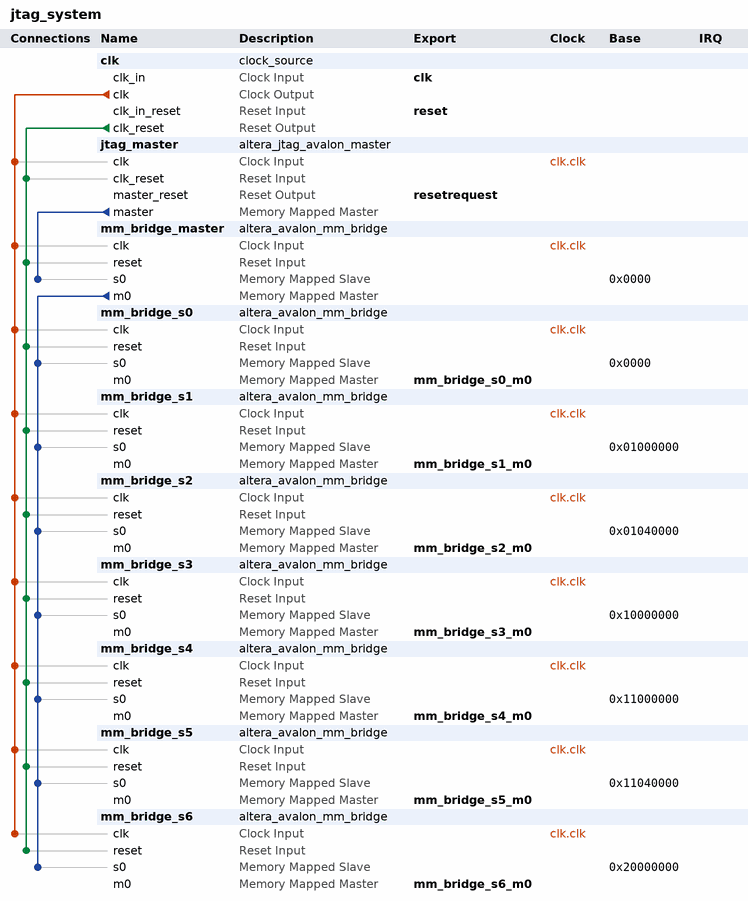
[diagram p0: system contents]
# Platform Designer (Qsys) system jtag_system, Arria V 5ASTMD3E3F31I3
# Parameters at their usual value, and those the tool derives, are not listed.
package require -exact qsys 14.0
create_system jtag_system
set_project_property DEVICE_FAMILY {Arria V}
set_project_property DEVICE 5ASTMD3E3F31I3

add_instance clk clock_source 14.0
set_instance_parameter_value clk clockFrequency 50000000
set_instance_parameter_value clk clockFrequencyKnown false

add_instance jtag_master altera_jtag_avalon_master 14.0

add_instance mm_bridge_master altera_avalon_mm_bridge 14.0
set_instance_parameter_value mm_bridge_master DATA_WIDTH 32
set_instance_parameter_value mm_bridge_master ADDRESS_WIDTH 32
set_instance_parameter_value mm_bridge_master USE_AUTO_ADDRESS_WIDTH 0
set_instance_parameter_value mm_bridge_master ADDRESS_UNITS SYMBOLS
set_instance_parameter_value mm_bridge_master MAX_BURST_SIZE 8
set_instance_parameter_value mm_bridge_master MAX_PENDING_RESPONSES 1
set_instance_parameter_value mm_bridge_master PIPELINE_COMMAND 0
set_instance_parameter_value mm_bridge_master PIPELINE_RESPONSE 0

add_instance mm_bridge_s0 altera_avalon_mm_bridge 14.0
set_instance_parameter_value mm_bridge_s0 DATA_WIDTH 32
set_instance_parameter_value mm_bridge_s0 ADDRESS_WIDTH 24
set_instance_parameter_value mm_bridge_s0 USE_AUTO_ADDRESS_WIDTH 0
set_instance_parameter_value mm_bridge_s0 ADDRESS_UNITS SYMBOLS
set_instance_parameter_value mm_bridge_s0 MAX_BURST_SIZE 8
set_instance_parameter_value mm_bridge_s0 MAX_PENDING_RESPONSES 1
set_instance_parameter_value mm_bridge_s0 PIPELINE_COMMAND 0
set_instance_parameter_value mm_bridge_s0 PIPELINE_RESPONSE 0

add_instance mm_bridge_s1 altera_avalon_mm_bridge 14.0
set_instance_parameter_value mm_bridge_s1 DATA_WIDTH 32
set_instance_parameter_value mm_bridge_s1 ADDRESS_WIDTH 18
set_instance_parameter_value mm_bridge_s1 USE_AUTO_ADDRESS_WIDTH 0
set_instance_parameter_value mm_bridge_s1 ADDRESS_UNITS SYMBOLS
set_instance_parameter_value mm_bridge_s1 MAX_BURST_SIZE 8
set_instance_parameter_value mm_bridge_s1 MAX_PENDING_RESPONSES 1
set_instance_parameter_value mm_bridge_s1 PIPELINE_COMMAND 0
set_instance_parameter_value mm_bridge_s1 PIPELINE_RESPONSE 0

add_instance mm_bridge_s2 altera_avalon_mm_bridge 14.0
set_instance_parameter_value mm_bridge_s2 DATA_WIDTH 32
set_instance_parameter_value mm_bridge_s2 ADDRESS_WIDTH 18
set_instance_parameter_value mm_bridge_s2 USE_AUTO_ADDRESS_WIDTH 0
set_instance_parameter_value mm_bridge_s2 ADDRESS_UNITS SYMBOLS
set_instance_parameter_value mm_bridge_s2 MAX_BURST_SIZE 8
set_instance_parameter_value mm_bridge_s2 MAX_PENDING_RESPONSES 1
set_instance_parameter_value mm_bridge_s2 PIPELINE_COMMAND 0
set_instance_parameter_value mm_bridge_s2 PIPELINE_RESPONSE 0

add_instance mm_bridge_s3 altera_avalon_mm_bridge 14.0
set_instance_parameter_value mm_bridge_s3 DATA_WIDTH 32
set_instance_parameter_value mm_bridge_s3 ADDRESS_WIDTH 24
set_instance_parameter_value mm_bridge_s3 USE_AUTO_ADDRESS_WIDTH 0
set_instance_parameter_value mm_bridge_s3 ADDRESS_UNITS SYMBOLS
set_instance_parameter_value mm_bridge_s3 MAX_BURST_SIZE 8
set_instance_parameter_value mm_bridge_s3 MAX_PENDING_RESPONSES 1
set_instance_parameter_value mm_bridge_s3 PIPELINE_COMMAND 0
set_instance_parameter_value mm_bridge_s3 PIPELINE_RESPONSE 0

add_instance mm_bridge_s4 altera_avalon_mm_bridge 14.0
set_instance_parameter_value mm_bridge_s4 DATA_WIDTH 32
set_instance_parameter_value mm_bridge_s4 ADDRESS_WIDTH 18
set_instance_parameter_value mm_bridge_s4 USE_AUTO_ADDRESS_WIDTH 0
set_instance_parameter_value mm_bridge_s4 ADDRESS_UNITS SYMBOLS
set_instance_parameter_value mm_bridge_s4 MAX_BURST_SIZE 8
set_instance_parameter_value mm_bridge_s4 MAX_PENDING_RESPONSES 1
set_instance_parameter_value mm_bridge_s4 PIPELINE_COMMAND 0
set_instance_parameter_value mm_bridge_s4 PIPELINE_RESPONSE 0

add_instance mm_bridge_s5 altera_avalon_mm_bridge 14.0
set_instance_parameter_value mm_bridge_s5 DATA_WIDTH 32
set_instance_parameter_value mm_bridge_s5 ADDRESS_WIDTH 18
set_instance_parameter_value mm_bridge_s5 USE_AUTO_ADDRESS_WIDTH 0
set_instance_parameter_value mm_bridge_s5 ADDRESS_UNITS SYMBOLS
set_instance_parameter_value mm_bridge_s5 MAX_BURST_SIZE 8
set_instance_parameter_value mm_bridge_s5 MAX_PENDING_RESPONSES 1
set_instance_parameter_value mm_bridge_s5 PIPELINE_COMMAND 0
set_instance_parameter_value mm_bridge_s5 PIPELINE_RESPONSE 0

add_instance mm_bridge_s6 altera_avalon_mm_bridge 14.0
set_instance_parameter_value mm_bridge_s6 DATA_WIDTH 32
set_instance_parameter_value mm_bridge_s6 ADDRESS_WIDTH 18
set_instance_parameter_value mm_bridge_s6 USE_AUTO_ADDRESS_WIDTH 0
set_instance_parameter_value mm_bridge_s6 ADDRESS_UNITS SYMBOLS
set_instance_parameter_value mm_bridge_s6 MAX_BURST_SIZE 8
set_instance_parameter_value mm_bridge_s6 MAX_PENDING_RESPONSES 1
set_instance_parameter_value mm_bridge_s6 PIPELINE_COMMAND 0
set_instance_parameter_value mm_bridge_s6 PIPELINE_RESPONSE 0

# connections
add_connection clk.clk jtag_master.clk clock
add_connection clk.clk mm_bridge_master.clk clock
add_connection clk.clk mm_bridge_s0.clk clock
add_connection clk.clk mm_bridge_s1.clk clock
add_connection clk.clk mm_bridge_s2.clk clock
add_connection clk.clk mm_bridge_s3.clk clock
add_connection clk.clk mm_bridge_s4.clk clock
add_connection clk.clk mm_bridge_s5.clk clock
add_connection clk.clk mm_bridge_s6.clk clock
add_connection clk.clk_reset jtag_master.clk_reset reset
add_connection clk.clk_reset mm_bridge_master.reset reset
add_connection clk.clk_reset mm_bridge_s0.reset reset
add_connection clk.clk_reset mm_bridge_s1.reset reset
add_connection clk.clk_reset mm_bridge_s2.reset reset
add_connection clk.clk_reset mm_bridge_s3.reset reset
add_connection clk.clk_reset mm_bridge_s4.reset reset
add_connection clk.clk_reset mm_bridge_s5.reset reset
add_connection clk.clk_reset mm_bridge_s6.reset reset
add_connection jtag_master.master mm_bridge_master.s0 avalon
set_connection_parameter_value jtag_master.master/mm_bridge_master.s0 baseAddress 0x0000
add_connection mm_bridge_master.m0 mm_bridge_s0.s0 avalon
set_connection_parameter_value mm_bridge_master.m0/mm_bridge_s0.s0 baseAddress 0x0000
add_connection mm_bridge_master.m0 mm_bridge_s1.s0 avalon
set_connection_parameter_value mm_bridge_master.m0/mm_bridge_s1.s0 baseAddress 0x01000000
add_connection mm_bridge_master.m0 mm_bridge_s2.s0 avalon
set_connection_parameter_value mm_bridge_master.m0/mm_bridge_s2.s0 baseAddress 0x01040000
add_connection mm_bridge_master.m0 mm_bridge_s3.s0 avalon
set_connection_parameter_value mm_bridge_master.m0/mm_bridge_s3.s0 baseAddress 0x10000000
add_connection mm_bridge_master.m0 mm_bridge_s4.s0 avalon
set_connection_parameter_value mm_bridge_master.m0/mm_bridge_s4.s0 baseAddress 0x11000000
add_connection mm_bridge_master.m0 mm_bridge_s5.s0 avalon
set_connection_parameter_value mm_bridge_master.m0/mm_bridge_s5.s0 baseAddress 0x11040000
add_connection mm_bridge_master.m0 mm_bridge_s6.s0 avalon
set_connection_parameter_value mm_bridge_master.m0/mm_bridge_s6.s0 baseAddress 0x20000000

# exported interfaces
add_interface clk clock sink
set_interface_property clk EXPORT_OF clk.clk_in
add_interface reset reset sink
set_interface_property reset EXPORT_OF clk.clk_in_reset
add_interface resetrequest reset source
set_interface_property resetrequest EXPORT_OF jtag_master.master_reset
add_interface mm_bridge_s0_m0 avalon master
set_interface_property mm_bridge_s0_m0 EXPORT_OF mm_bridge_s0.m0
add_interface mm_bridge_s2_m0 avalon master
set_interface_property mm_bridge_s2_m0 EXPORT_OF mm_bridge_s2.m0
add_interface mm_bridge_s3_m0 avalon master
set_interface_property mm_bridge_s3_m0 EXPORT_OF mm_bridge_s3.m0
add_interface mm_bridge_s1_m0 avalon master
set_interface_property mm_bridge_s1_m0 EXPORT_OF mm_bridge_s1.m0
add_interface mm_bridge_s4_m0 avalon master
set_interface_property mm_bridge_s4_m0 EXPORT_OF mm_bridge_s4.m0
add_interface mm_bridge_s5_m0 avalon master
set_interface_property mm_bridge_s5_m0 EXPORT_OF mm_bridge_s5.m0
add_interface mm_bridge_s6_m0 avalon master
set_interface_property mm_bridge_s6_m0 EXPORT_OF mm_bridge_s6.m0

set_interconnect_requirement {$system} qsys_mm.clockCrossingAdapter HANDSHAKE
set_interconnect_requirement {$system} qsys_mm.maxAdditionalLatency 1
set_interconnect_requirement {$system} qsys_mm.insertDefaultSlave FALSE

save_system jtag_system.qsys
